# EAGLE design MP4GS_Power (EAGLE 7.4.0)
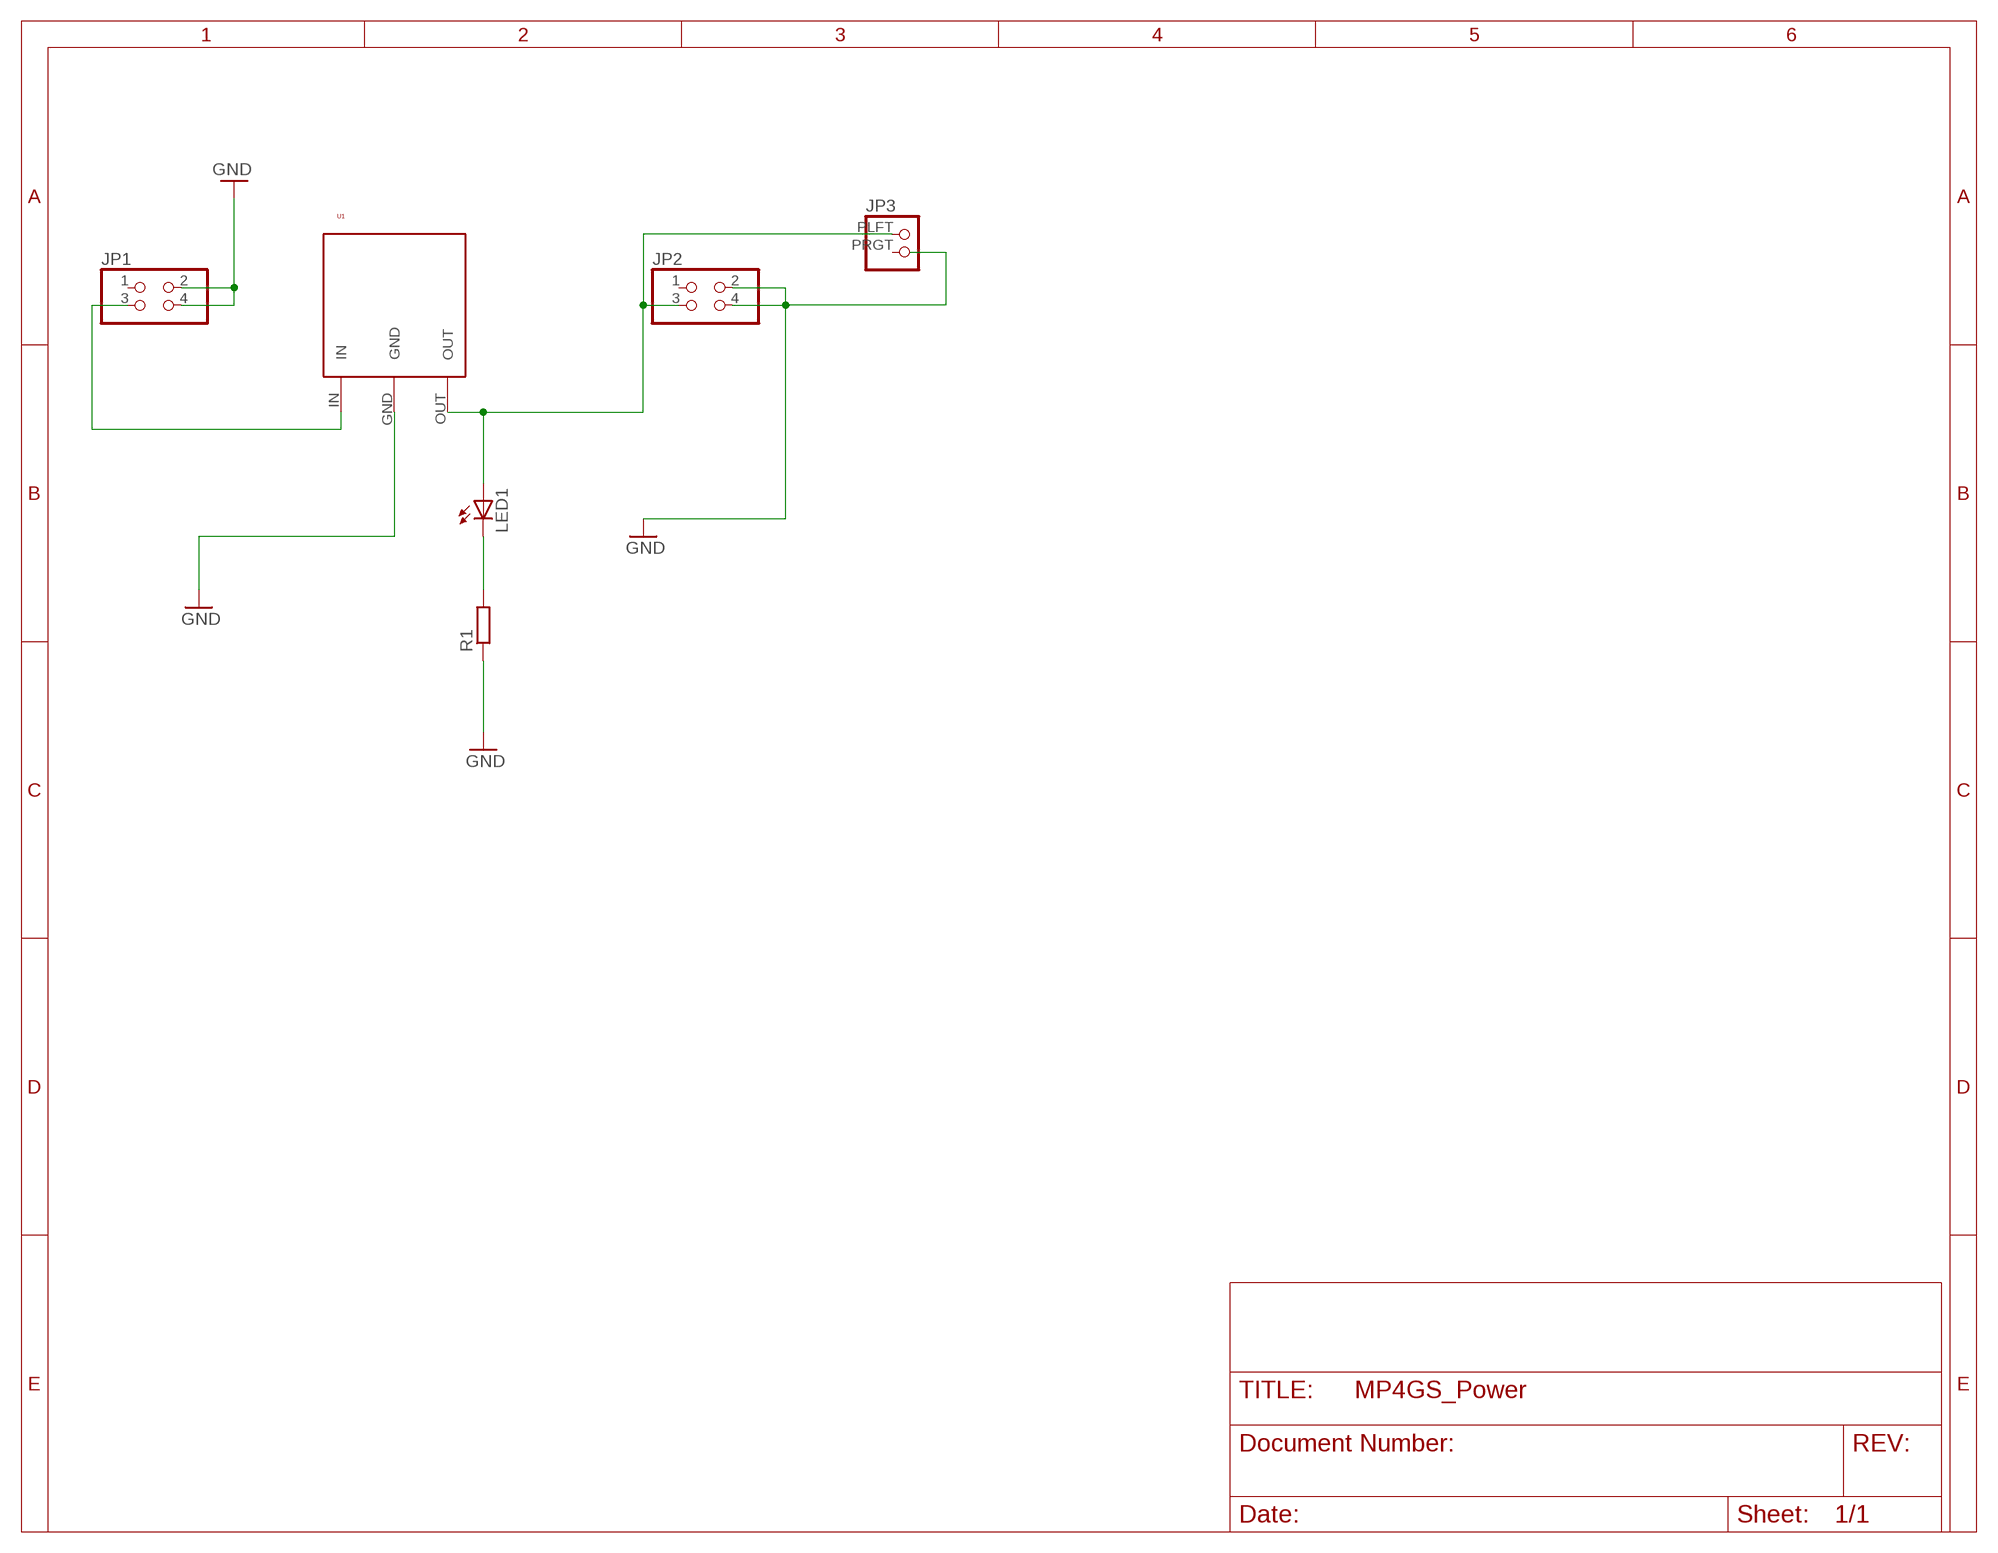
[diagram p0: schematic, sheet 1]

## Parts
JP1  PINHD-2X2  [2X02]
JP2  PINHD-2X2  [2X02]
JP3  PINHD-1X2  [1X02]
LED1  LED5MM  [LED5MM]
R1  R-EU_0207/10  [0207/10]
U1  L7808AB  [L78-DDPAK]

## Nets
GND: JP1.2 JP1.4 JP2.2 JP2.4 R1.1 U1.GND
N$1: JP1.3 U1.IN
N$2: JP2.3 JP3.PLFT LED1.A U1.OUT
N$3: LED1.K(C) R1.2
Unconnected: JP1.1 JP2.1 JP3.PRGT

## Library data of the parts
JP1 JP2 = Haddock:PINHD-2X2: 2x2 Pin Header with the rows connected by pads
JP3 = Haddock:PINHD-1X2: PIN HEADER
LED1 = led:LED: LED OSRAM: - CHIPLED LG R971, LG N971, LY N971, LG Q971, LY Q971, LO R971, LY R971 LH N974, LH R974 LS Q976, LO Q976, LY Q976 LO Q996 - Hyper CHIPLED LW Q18S LB Q993, LB Q99A, LB R99A - SideLED LS A670, LO A670, LY A670, LG A670, LP A670 LB A673, LV A673, LT A673, LW A673 LH A674 LY A675 LS A676, LA A676, LO A676, LY A676, LW A676 LS A679, LY A679, LG A679 - Hyper Micro SIDELED® LS Y876, LA Y876, LO Y876, LY Y876 LT Y87S - SmartLED LW L88C, LW L88S LB L89C, LB L89S, LG L890 LS L89K, LO L89K, LY L89K LS L896, LA L896, LO L896, LY L896 - TOPLED LS T670, LO T670, LY T670, LG T670, LP T670 LSG T670, LSP T670, LSY T670, LOP T670, LYG T670 LG T671, LOG T671, LSG T671 LB T673, LV T673, LT T673, LW T673 LH T674 LS T676, LA T676, LO T676, LY T676, LB T676, LH T676, LSB T676, LW T676 LB T67C, LV T67C, LT T67C, LS T67K, LO T67K, LY T67K, LW E67C LS E67B, LA E67B, LO E67B, LY E67B, LB E67C, LV E67C, LT E67C LW T67C LS T679, LY T679, LG T679 LS T770, LO T770, LY T770, LG T770, LP T770 LB T773, LV T773, LT T773, LW T773 LH T774 LS E675, LA E675, LY E675, LS T675 LS T776, LA T776, LO T776, LY T776, LB T776 LHGB T686 LT T68C, LB T68C - Hyper Mini TOPLED® LB M676 - Mini TOPLED Santana® LG M470 LS M47K, LO M47K, LY M47K Source: http://www.osram.convergy.de LUXEON: - LUMILED® LXK2-PW12-R00, LXK2-PW12-S00, LXK2-PW14-U00, LXK2-PW14-V00 LXK2-PM12-R00, LXK2-PM12-S00, LXK2-PM14-U00 LXK2-PE12-Q00, LXK2-PE12-R00, LXK2-PE12-S00, LXK2-PE14-T00, LXK2-PE14-U00 LXK2-PB12-K00, LXK2-PB12-L00, LXK2-PB12-M00, LXK2-PB14-N00, LXK2-PB14-P00, LXK2-PB14-Q00 LXK2-PR12-L00, LXK2-PR12-M00, LXK2-PR14-Q00, LXK2-PR14-R00 LXK2-PD12-Q00, LXK2-PD12-R00, LXK2-PD12-S00 LXK2-PH12-R00, LXK2-PH12-S00 LXK2-PL12-P00, LXK2-PL12-Q00, LXK2-PL12-R00 Source: www.luxeon.com KINGBRIGHT: KA-3528ASYC Source: www.kingbright.com
R1 = rcl:R-EU_: RESISTOR, European symbol
U1 = Haddock:L7808AB: L78 8V 1.5A regulator in a DDPAK package

## Net classes
0 default: width 0.15 mm, drill 0.3 mm, clearance 0.15 mm

## Board
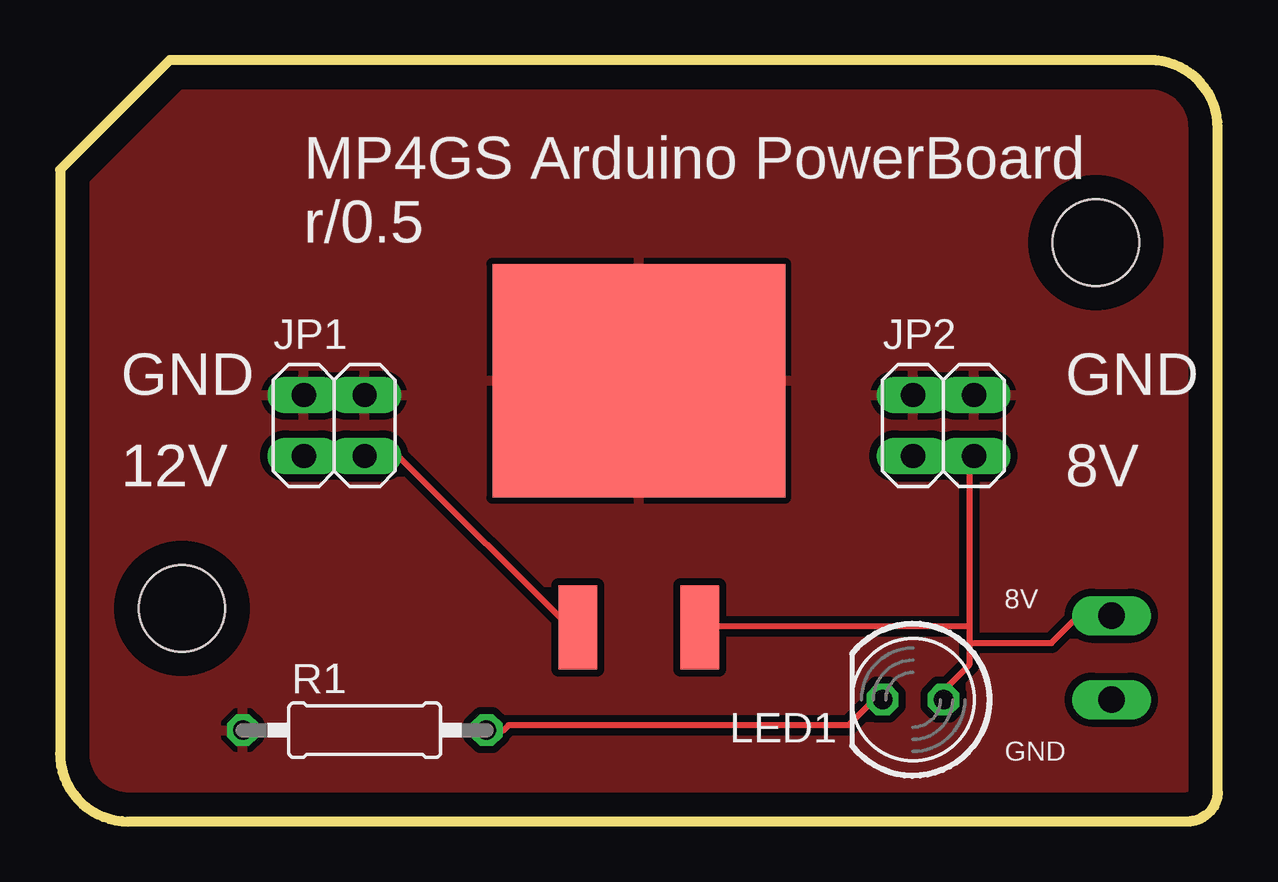
[diagram p1: board, top side]
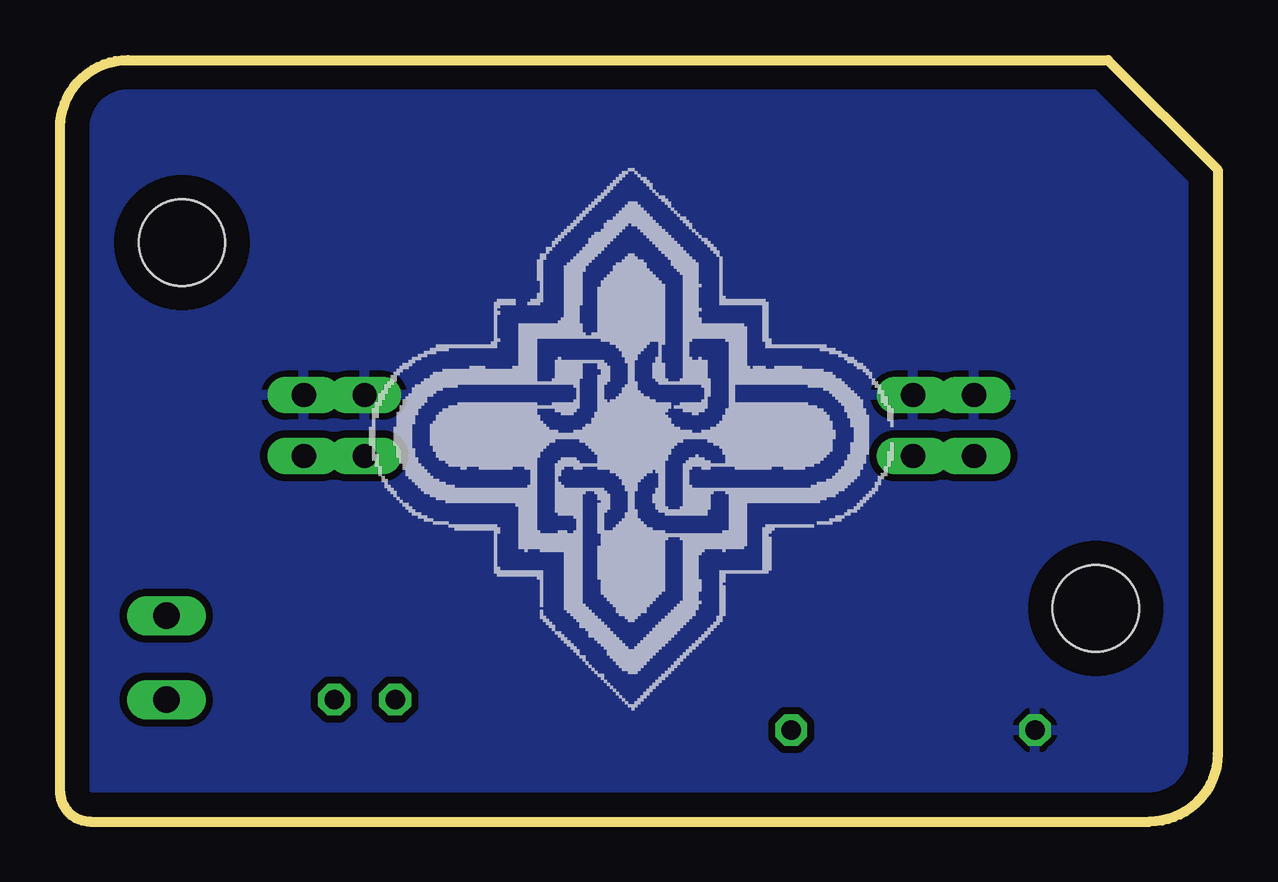
[diagram p2: board, bottom side, seen from below]

Size 48.26 x 31.75 mm. Coordinates in mm from the lower left corner, seen from the top.
Outline: 48.26,1.27 48.26,28.91 arc90 45.42,31.75 4.58,31.75 0,27.17 0,2.84 arc90 2.84,0 46.99,0 arc90 48.26,1.27
Copper layers (1*16): Top 0.035mm / dielectric 1.5mm / Bottom 0.035mm
Design rules "default": minimum track width 10mil, minimum drill 24mil, track to track 8mil, track to pad 8mil, pad to pad 8mil, via to via 8mil, smd to smd 8mil, copper to edge 40mil, drill to drill 8mil, minimum pad ring 10mil, minimum via ring 8mil, stop-mask expansion 4mil, vias tented up to drill 0mil, thermal gap 10mil
Holes 3.6 mm at 43.18,24.13 5.08,8.89

### Footprints (pad centres in the part's own frame; a part is rotated, then mirrored left to right if it is on the bottom)
2X02 = drill 1.016 long: 1 -1.27,-1.27; 2 -1.27,1.27; 3 1.27,-1.27; 4 1.27,1.27 | smd 1.27 x 0.635: P$1 0,1.27; P$2 0,-1.27 | smd 1.27 x 0.635 bottom: P$3 0,1.27; P$4 0,-1.27
1X02 = drill 1.1 long: PLFT -3.5,7; PRGT 0,7
LED5MM = drill 0.813 octagon: A -1.27,0; K 1.27,0
0207/10 = drill 0.813 octagon: 1 -5.08,0; 2 5.08,0
L78-DDPAK = smd 12.2 x 9.75: GND 0,12.025 | smd 1.6 x 3.5: IN -2.54,1.75; OUT 2.54,1.75

### Placement (x,y rotation side)
JP1  11.43,16.51 0 top
JP2  36.83,16.51 0 top
JP3  36.83,5.08 270 top
LED1  35.56,5.08 180 top
R1  12.7,3.81 0 top
U1  24.13,6.35 0 top

### Tracks (layer width: path | path; a pad name or v marks a point on that pad's centre or on a via)
GND
  pour Top (isolate 0.305): 0,26.67 0,0 48.26,0 48.26,31.75 0,31.75
  pour Bottom (isolate 0.305): 0,26.67 0,0 48.26,0 48.26,31.75 0,31.75
N$1
  Top 0.254: JP1.3 12.75,15.21 14.12,15.21 21.44,7.9 U1.IN
N$2
  Top 0.254: 37.9,8.13 37.9,15.21 JP2.3 | 37.9,8.13 37.9,7.44 | 37.9,7.44 37.9,6.53 36.98,5.61 36.98,5.16 LED1.A | 37.9,8.13 26.69,8.13 U1.OUT | 37.9,7.44 41.33,7.44 42.24,8.36 43.61,8.36 JP3.PLFT
N$3
  Top 0.254: R1.2 17.78,3.79 18.47,3.79 18.69,4.01 32.87,4.01 33.78,4.93 34.24,4.93 LED1.K

### Text on the board
tPlace: MP4GS Arduino PowerBoard / r/0.5 | GND | GND | 12V | 8V | 8V | GND